# EAGLE design STBlitter_RevA (EAGLE 9.4.2)
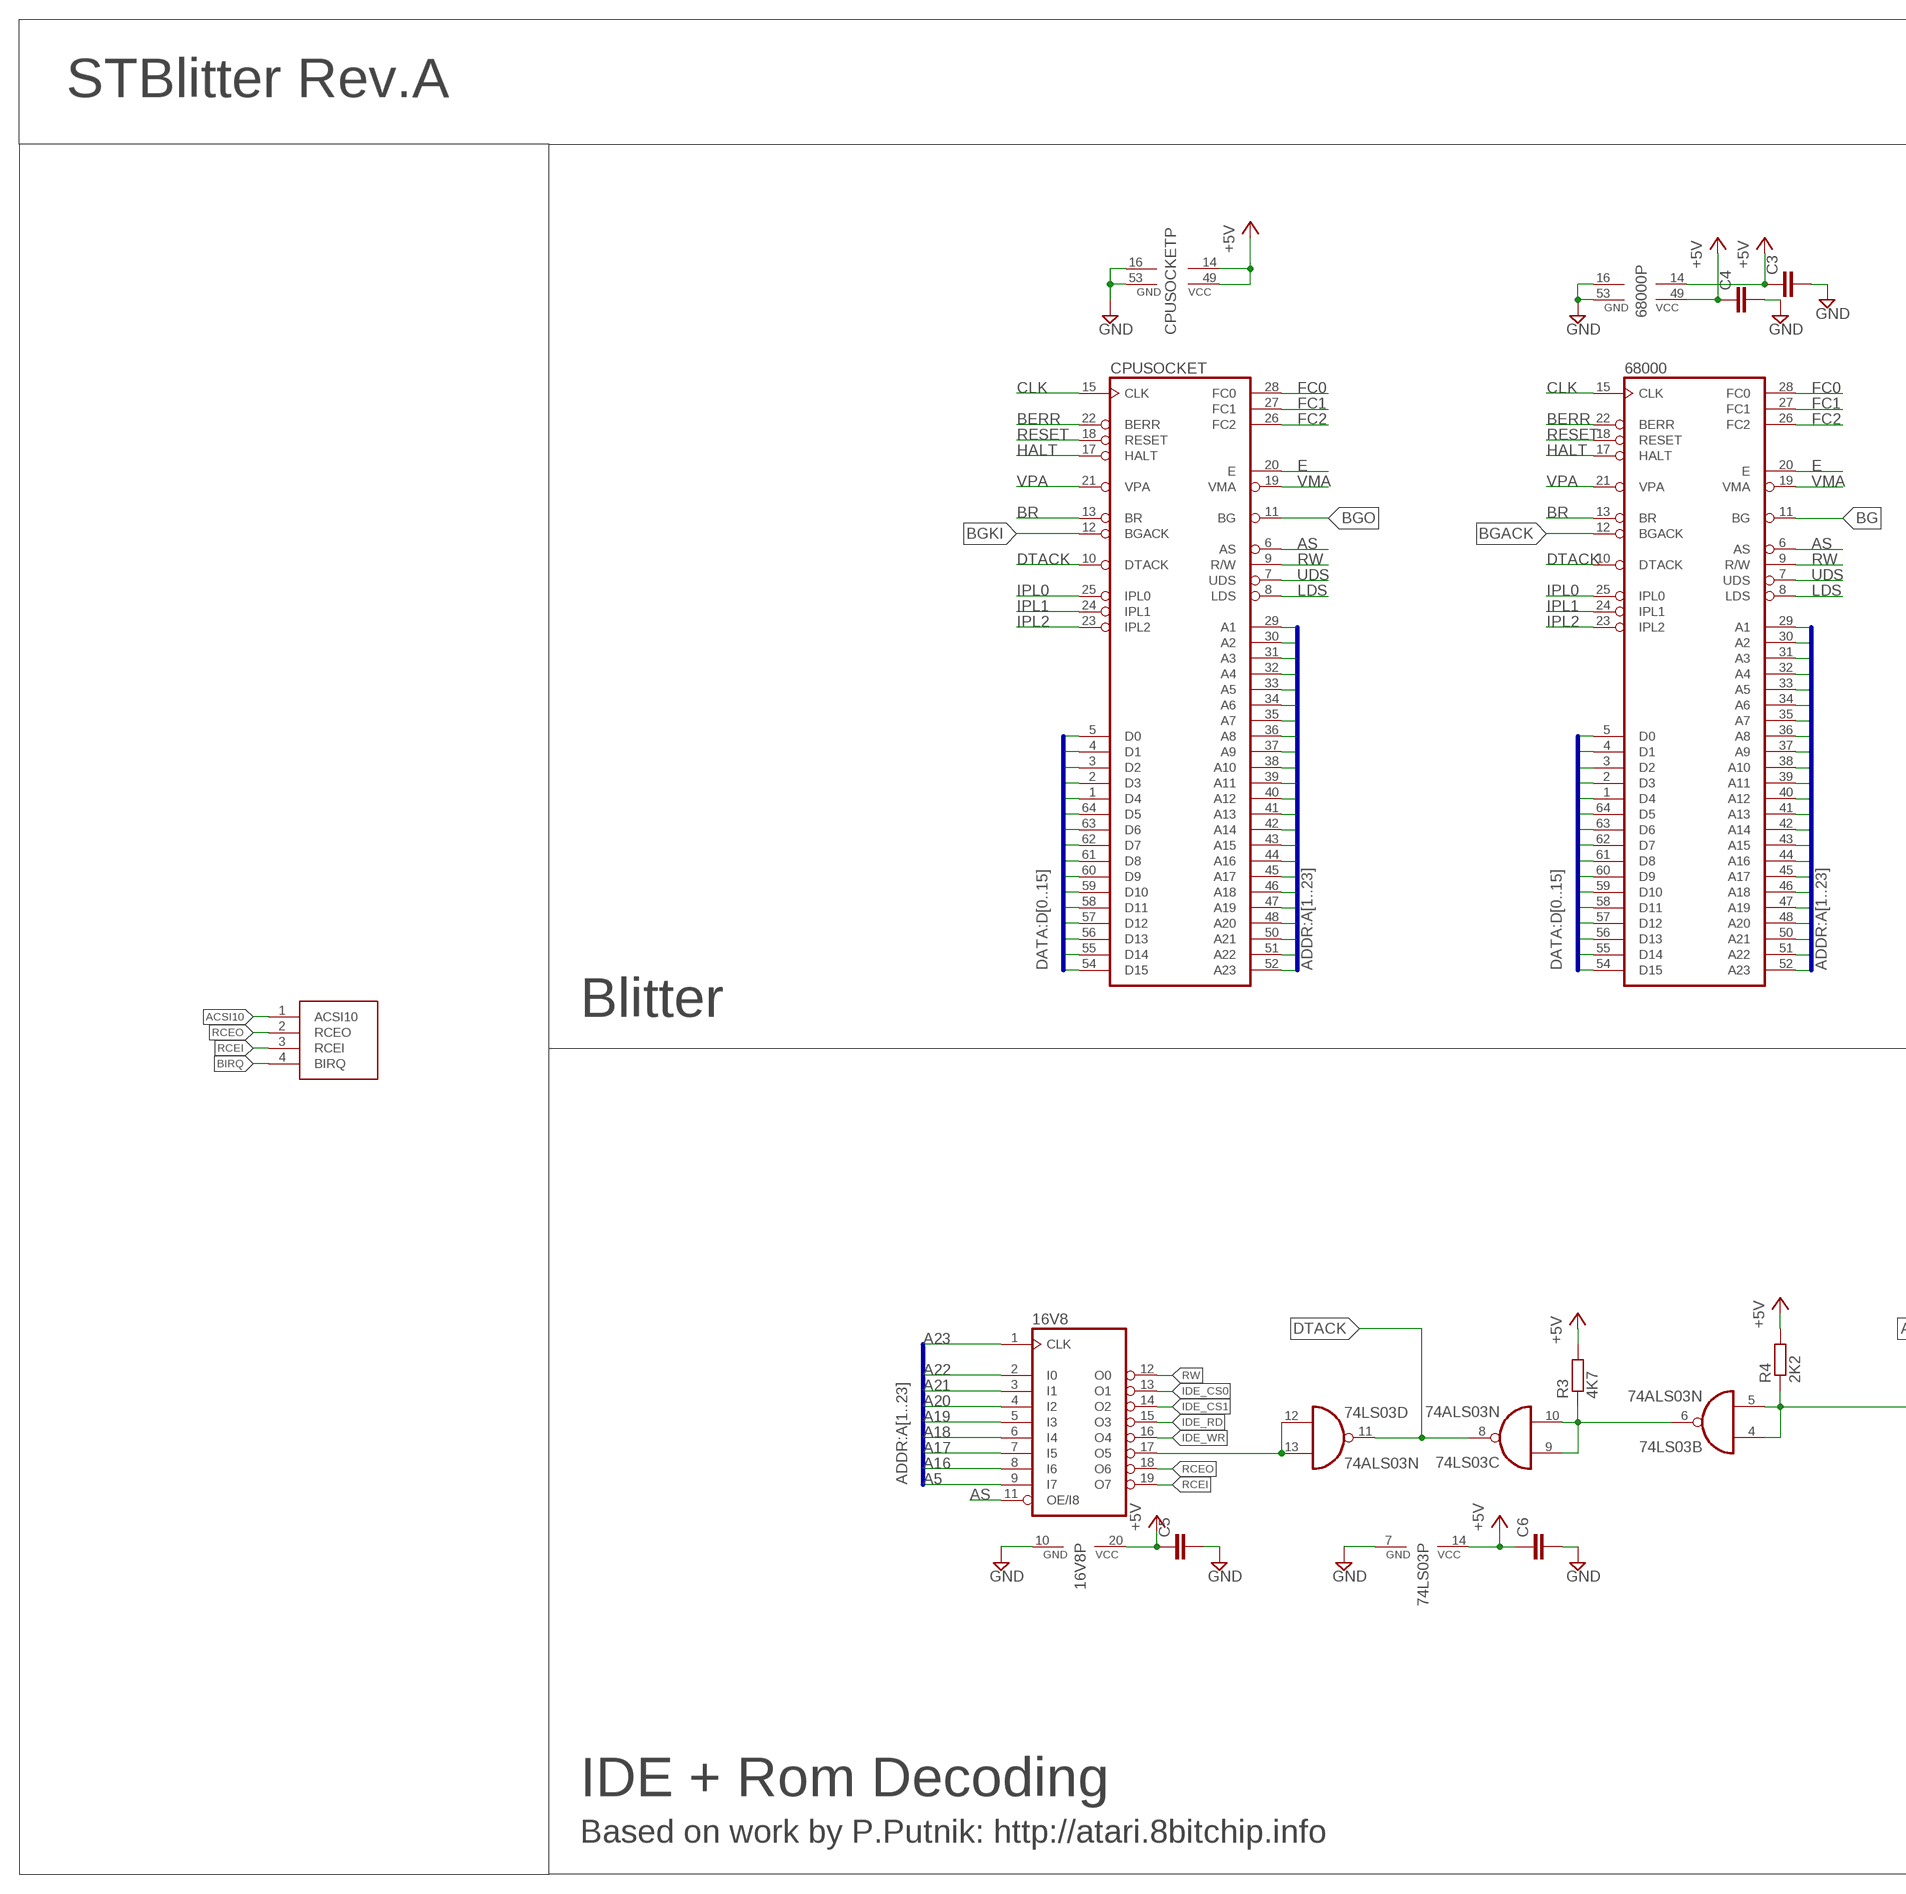
[diagram p0: schematic, sheet 1, part 1 of 2]
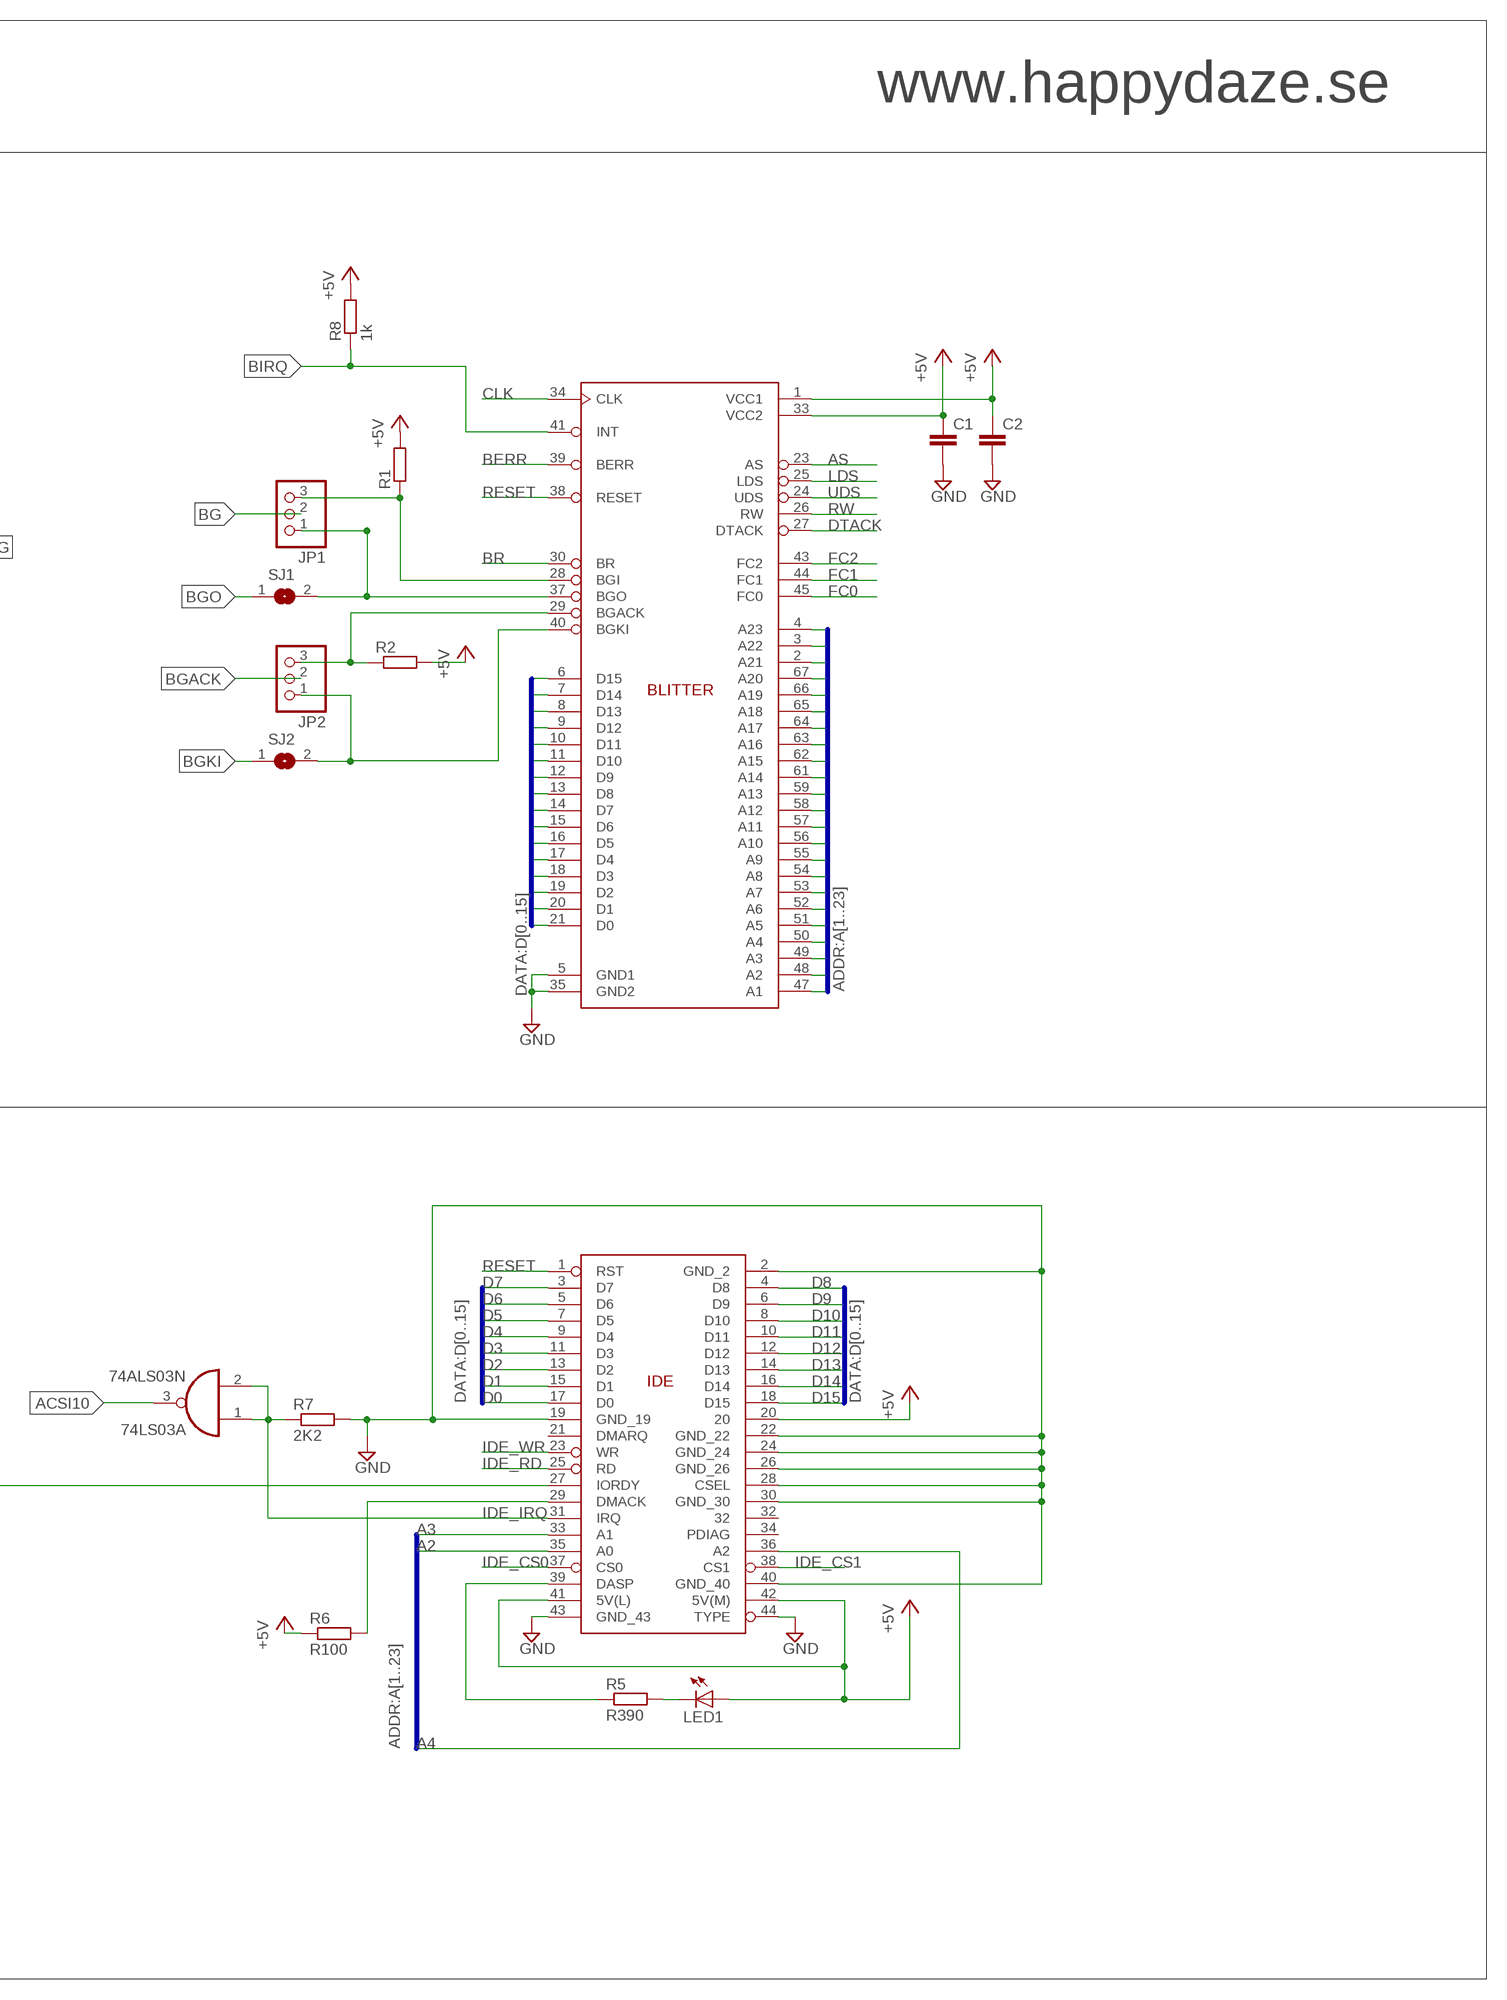
[diagram p1: schematic, sheet 1, part 2 of 2]

## Parts
16V8  16V8  [DIL20]
74LS03  74ALS03N  [DIL14]
68000  MC68000P  [DIL64]
C1  C-EU050-025X075  [C050-025X075]
C2  C-EU050-025X075  [C050-025X075]
C3  C-EU050-025X075  [C050-025X075]
C4  C-EU050-025X075  [C050-025X075]
C5  C-EU050-025X075  [C050-025X075]
C6  C-EU050-025X075  [C050-025X075]
CFCARD  IDE44_CON  [IDE44_CON]
CPUSOCKET  MC68000P  [DIL64]
JP1  PINHD-1X3  [1X03]
JP2  PINHD-1X3  [1X03]
LED1  LED3MM  [LED3MM]
R1  R-EU_0207/12  [0207/12]
R2  R-EU_0207/12  [0207/12]
R3  4K7  R-EU_0207/12  [0207/12]
R4  2K2  R-EU_0207/12  [0207/12]
R5  R390  R-EU_0207/12  [0207/12]
R6  R100  R-EU_0207/12  [0207/12]
R7  2K2  R-EU_0207/12  [0207/12]
R8  1k  R-EU_0207/12  [0207/12]
SJ1  SJ  [SJ]
SJ2  SJ  [SJ]
U$1  STBLITTER  [S68]
U$2  XCON  [XCON]

## Nets
+5V [PWR]: 16V8.20(VCC) 74LS03.14(P:VCC) 68000.14(VCC) 68000.49(VCC) C1.1 C2.1 C3.1 C4.1 C5.1 C6.1 CFCARD.20 CFCARD.41(5V(L)) CFCARD.42(5V(M)) CPUSOCKET.14(VCC) CPUSOCKET.49(VCC) LED1.A R1.2 R2.2 R3.2 R4.2 R6.1 R8.2 U$1.1(VCC1) U$1.33(VCC2)
_BGACK: JP2.3 R2.1 U$1.29(BGACK)
_BGKI: JP2.1 SJ2.2 U$1.40(BGKI)
_BGO: JP1.1 SJ1.2 U$1.37(BGO)
A1: 68000.29(A1) CPUSOCKET.29(A1) U$1.47(A1)
A2: 68000.30(A2) CFCARD.35(A0) CPUSOCKET.30(A2) U$1.48(A2)
A3: 68000.31(A3) CFCARD.33(A1) CPUSOCKET.31(A3) U$1.49(A3)
A4: 68000.32(A4) CFCARD.36(A2) CPUSOCKET.32(A4) U$1.50(A4)
A5: 16V8.9(I7) 68000.33(A5) CPUSOCKET.33(A5) U$1.51(A5)
A6: 68000.34(A6) CPUSOCKET.34(A6) U$1.52(A6)
A7: 68000.35(A7) CPUSOCKET.35(A7) U$1.53(A7)
A8: 68000.36(A8) CPUSOCKET.36(A8) U$1.54(A8)
A9: 68000.37(A9) CPUSOCKET.37(A9) U$1.55(A9)
A10: 68000.38(A10) CPUSOCKET.38(A10) U$1.56(A10)
A11: 68000.39(A11) CPUSOCKET.39(A11) U$1.57(A11)
A12: 68000.40(A12) CPUSOCKET.40(A12) U$1.58(A12)
A13: 68000.41(A13) CPUSOCKET.41(A13) U$1.59(A13)
A14: 68000.42(A14) CPUSOCKET.42(A14) U$1.61(A14)
A15: 68000.43(A15) CPUSOCKET.43(A15) U$1.62(A15)
A16: 16V8.8(I6) 68000.44(A16) CPUSOCKET.44(A16) U$1.63(A16)
A17: 16V8.7(I5) 68000.45(A17) CPUSOCKET.45(A17) U$1.64(A17)
A18: 16V8.6(I4) 68000.46(A18) CPUSOCKET.46(A18) U$1.65(A18)
A19: 16V8.5(I3) 68000.47(A19) CPUSOCKET.47(A19) U$1.66(A19)
A20: 16V8.4(I2) 68000.48(A20) CPUSOCKET.48(A20) U$1.67(A20)
A21: 16V8.3(I1) 68000.50(A21) CPUSOCKET.50(A21) U$1.2(A21)
A22: 16V8.2(I0) 68000.51(A22) CPUSOCKET.51(A22) U$1.3(A22)
A23: 16V8.1(CLK) 68000.52(A23) CPUSOCKET.52(A23) U$1.4(A23)
ACSI10: 74LS03.3(A:O) U$2.1(ACSI10)
AS: 16V8.11(OE/I8) 68000.6(AS) CPUSOCKET.6(AS) U$1.23(AS)
BERR: 68000.22(BERR) CPUSOCKET.22(BERR) U$1.39(BERR)
BG: 68000.11(BG) JP1.2
BGACK: 68000.12(BGACK) JP2.2
BGKI: CPUSOCKET.12(BGACK) SJ2.1
BGO: CPUSOCKET.11(BG) SJ1.1
BIRQ: R8.1 U$1.41(INT) U$2.4(BIRQ)
BLTBGI: JP1.3 R1.1 U$1.28(BGI)
BR: 68000.13(BR) CPUSOCKET.13(BR) U$1.30(BR)
CLK: 68000.15(CLK) CPUSOCKET.15(CLK) U$1.34(CLK)
D0: 68000.5(D0) CFCARD.17(D0) CPUSOCKET.5(D0) U$1.21(D0)
D1: 68000.4(D1) CFCARD.15(D1) CPUSOCKET.4(D1) U$1.20(D1)
D2: 68000.3(D2) CFCARD.13(D2) CPUSOCKET.3(D2) U$1.19(D2)
D3: 68000.2(D3) CFCARD.11(D3) CPUSOCKET.2(D3) U$1.18(D3)
D4: 68000.1(D4) CFCARD.9(D4) CPUSOCKET.1(D4) U$1.17(D4)
D5: 68000.64(D5) CFCARD.7(D5) CPUSOCKET.64(D5) U$1.16(D5)
D6: 68000.63(D6) CFCARD.5(D6) CPUSOCKET.63(D6) U$1.15(D6)
D7: 68000.62(D7) CFCARD.3(D7) CPUSOCKET.62(D7) U$1.14(D7)
D8: 68000.61(D8) CFCARD.4(D8) CPUSOCKET.61(D8) U$1.13(D8)
D9: 68000.60(D9) CFCARD.6(D9) CPUSOCKET.60(D9) U$1.12(D9)
D10: 68000.59(D10) CFCARD.8(D10) CPUSOCKET.59(D10) U$1.11(D10)
D11: 68000.58(D11) CFCARD.10(D11) CPUSOCKET.58(D11) U$1.10(D11)
D12: 68000.57(D12) CFCARD.12(D12) CPUSOCKET.57(D12) U$1.9(D12)
D13: 68000.56(D13) CFCARD.14(D13) CPUSOCKET.56(D13) U$1.8(D13)
D14: 68000.55(D14) CFCARD.16(D14) CPUSOCKET.55(D14) U$1.7(D14)
D15: 68000.54(D15) CFCARD.18(D15) CPUSOCKET.54(D15) U$1.6(D15)
DTACK: 74LS03.8(C:O) 74LS03.11(D:O) 68000.10(DTACK) CPUSOCKET.10(DTACK) U$1.27(DTACK)
E: 68000.20(E) CPUSOCKET.20(E)
FC0: 68000.28(FC0) CPUSOCKET.28(FC0) U$1.45(FC0)
FC1: 68000.27(FC1) CPUSOCKET.27(FC1) U$1.44(FC1)
FC2: 68000.26(FC2) CPUSOCKET.26(FC2) U$1.43(FC2)
GND [GND]: 16V8.10(GND) 74LS03.7(P:GND) 68000.16(GND) 68000.53(GND) C1.2 C2.2 C3.2 C4.2 C5.2 C6.2 CFCARD.2(GND_2) CFCARD.19(GND_19) CFCARD.22(GND_22) CFCARD.24(GND_24) CFCARD.26(GND_26) CFCARD.28(CSEL) CFCARD.30(GND_30) CFCARD.40(GND_40) CFCARD.43(GND_43) CFCARD.44(TYPE) CPUSOCKET.16(GND) CPUSOCKET.53(GND) R7.2 U$1.5(GND1) U$1.35(GND2)
HALT: 68000.17(HALT) CPUSOCKET.17(HALT)
IDE_CS0: 16V8.13(O1) CFCARD.37(CS0)
IDE_CS1: 16V8.14(O2) CFCARD.38(CS1)
IDE_IRQ: 74LS03.1(A:I0) 74LS03.2(A:I1) CFCARD.31(IRQ) R7.1
IDE_RD: 16V8.15(O3) CFCARD.25(RD)
IDE_WR: 16V8.16(O4) CFCARD.23(WR)
IPL0: 68000.25(IPL0) CPUSOCKET.25(IPL0)
IPL1: 68000.24(IPL1) CPUSOCKET.24(IPL1)
IPL2: 68000.23(IPL2) CPUSOCKET.23(IPL2)
LDS: 68000.8(LDS) CPUSOCKET.8(LDS) U$1.25(LDS)
N$2: 16V8.17(O5) 74LS03.12(D:I0) 74LS03.13(D:I1)
N$3: 74LS03.6(B:O) 74LS03.9(C:I0) 74LS03.10(C:I1) R3.1
N$4: 74LS03.4(B:I0) 74LS03.5(B:I1) CFCARD.27(IORDY) R4.1
N$7: CFCARD.29(DMACK) R6.2
N$13: CFCARD.39(DASP) R5.1
N$14: LED1.K(C) R5.2
RCEI: 16V8.19(O7) U$2.3(RCEI)
RCEO: 16V8.18(O6) U$2.2(RCEO)
RESET: 68000.18(RESET) CFCARD.1(RST) CPUSOCKET.18(RESET) U$1.38(RESET)
RW: 16V8.12(O0) 68000.9(R/W) CPUSOCKET.9(R/W) U$1.26(RW)
UDS: 68000.7(UDS) CPUSOCKET.7(UDS) U$1.24(UDS)
VMA: 68000.19(VMA) CPUSOCKET.19(VMA)
VPA: 68000.21(VPA) CPUSOCKET.21(VPA)
Unconnected: CFCARD.21(DMARQ) CFCARD.32 CFCARD.34(PDIAG)

## Buses
DATA:D[0..15]
ADDR:A[1..23]

## Notes on the sheet
- STBlitter Rev.A | www.happydaze.se
- Blitter
- IDE + Rom Decoding
- Based on work by P.Putnik: http://atari.8bitchip.info

## Library data of the parts
16V8 = pal:16V8: PAL; MPN: GAL16V8D-7LPN; OC_FARNELL: 9699740; OC_NEWARK: 97K0449
74LS03 = 74xx-eu:74*03: Quad 2-input NAND gate, open collector output
68000 CPUSOCKET = micro-mc68000:MC68000P: 68xxx PROCESSOR; OC_FARNELL: unknown; OC_NEWARK: unknown
C1-C6 = rcl:C-EU: CAPACITOR, European symbol; SPICEPREFIX: C
CFCARD = AtariST:IDE44_CON
JP1 JP2 = pinhead:PINHD-1X3: PIN HEADER
LED1 = led:LED: LED OSRAM: - CHIPLED LG R971, LG N971, LY N971, LG Q971, LY Q971, LO R971, LY R971 LH N974, LH R974 LS Q976, LO Q976, LY Q976 LO Q996 - Hyper CHIPLED LW Q18S LB Q993, LB Q99A, LB R99A - SideLED LS A670, LO A670, LY A670, LG A670, LP A670 LB A673, LV A673, LT A673, LW A673 LH A674 LY A675 LS A676, LA A676, LO A676, LY A676, LW A676 LS A679, LY A679, LG A679 - Hyper Micro SIDELED® LS Y876, LA Y876, LO Y876, LY Y876 LT Y87S - SmartLED LW L88C, LW L88S LB L89C, LB L89S, LG L890 LS L89K, LO L89K, LY L89K LS L896, LA L896, LO L896, LY L896 - TOPLED LS T670, LO T670, LY T670, LG T670, LP T670 LSG T670, LSP T670, LSY T670, LOP T670, LYG T670 LG T671, LOG T671, LSG T671 LB T673, LV T673, LT T673, LW T673 LH T674 LS T676, LA T676, LO T676, LY T676, LB T676, LH T676, LSB T676, LW T676 LB T67C, LV T67C, LT T67C, LS T67K, LO T67K, LY T67K, LW E67C LS E67B, LA E67B, LO E67B, LY E67B, LB E67C, LV E67C, LT E67C LW T67C LS T679, LY T679, LG T679 LS T770, LO T770, LY T770, LG T770, LP T770 LB T773, LV T773, LT T773, LW T773 LH T774 LS E675, LA E675, LY E675, LS T675 LS T776, LA T776, LO T776, LY T776, LB T776 LHGB T686 LT T68C, LB T68C - Hyper Mini TOPLED® LB M676 - Mini TOPLED Santana® LG M470 LS M47K, LO M47K, LY M47K Source: http://www.osram.convergy.de LUXEON: - LUMILED® LXK2-PW12-R00, LXK2-PW12-S00, LXK2-PW14-U00, LXK2-PW14-V00 LXK2-PM12-R00, LXK2-PM12-S00, LXK2-PM14-U00 LXK2-PE12-Q00, LXK2-PE12-R00, LXK2-PE12-S00, LXK2-PE14-T00, LXK2-PE14-U00 LXK2-PB12-K00, LXK2-PB12-L00, LXK2-PB12-M00, LXK2-PB14-N00, LXK2-PB14-P00, LXK2-PB14-Q00 LXK2-PR12-L00, LXK2-PR12-M00, LXK2-PR14-Q00, LXK2-PR14-R00 LXK2-PD12-Q00, LXK2-PD12-R00, LXK2-PD12-S00 LXK2-PH12-R00, LXK2-PH12-S00 LXK2-PL12-P00, LXK2-PL12-Q00, LXK2-PL12-R00 Source: www.luxeon.com KINGBRIGHT: KA-3528ASYC Source: www.kingbright.com
R1-R8 = resistor:R-EU_: RESISTOR, European symbol
SJ1 SJ2 = jumper:SJ: SMD solder JUMPER
U$1 = AtariST:STBLITTER
U$2 = AtariST:XCON

## Net classes
0 default: width 0.203 mm
1 PWR: width 0.813 mm
2 GND: width 0.813 mm

## Board
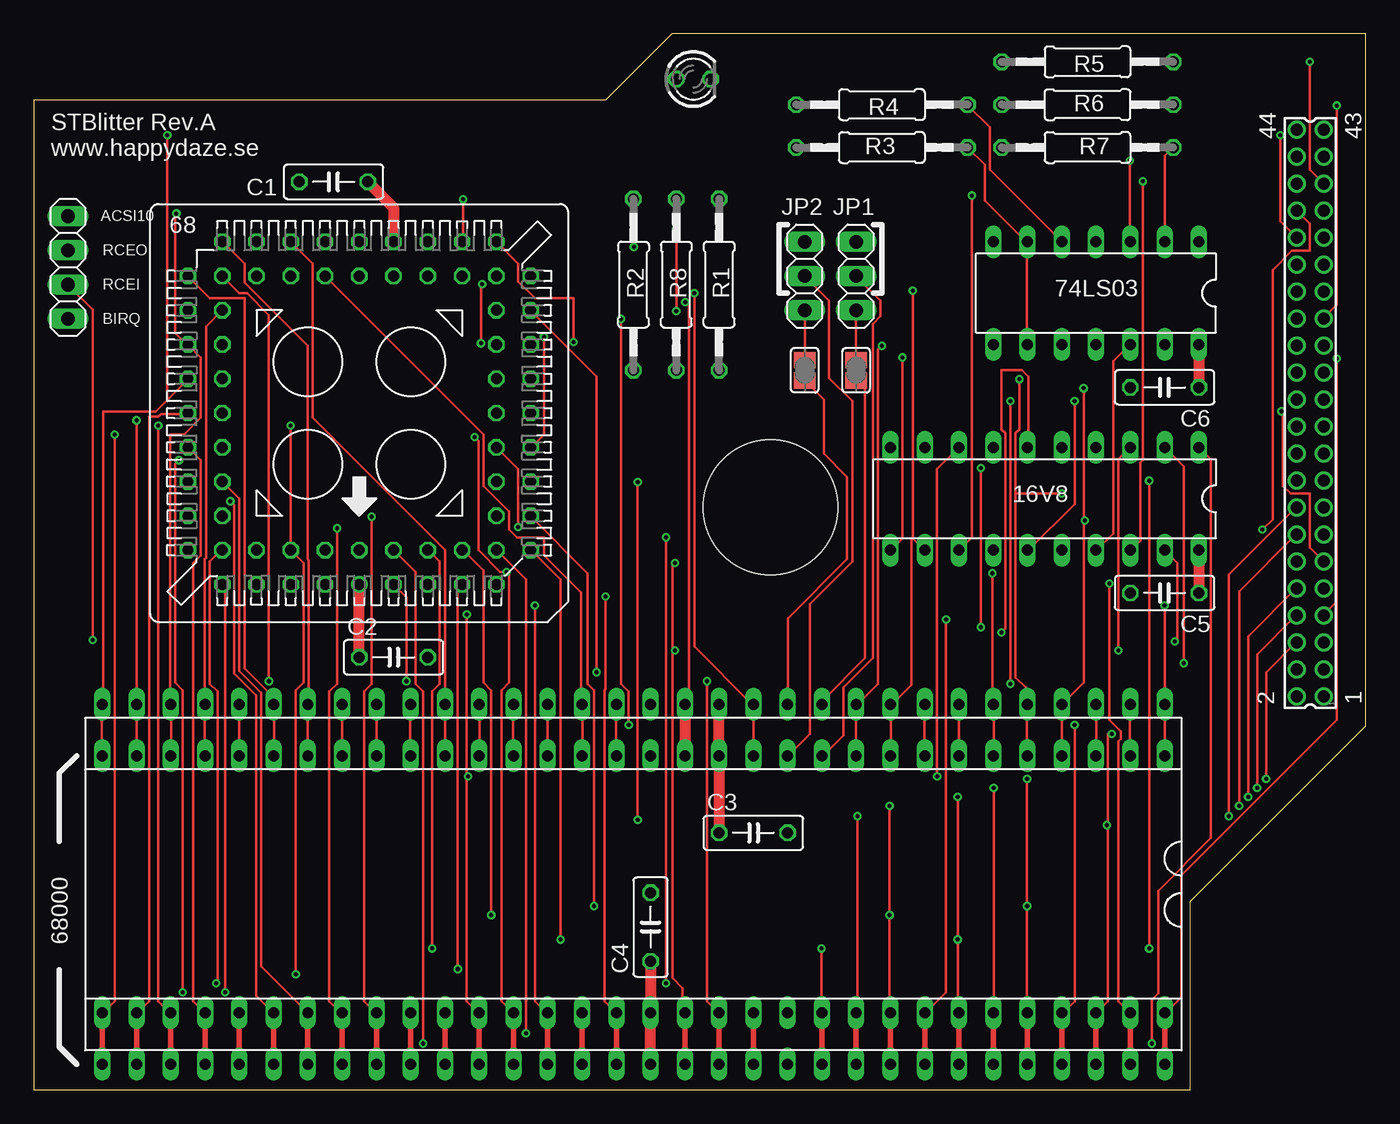
[diagram p2: board, top side]
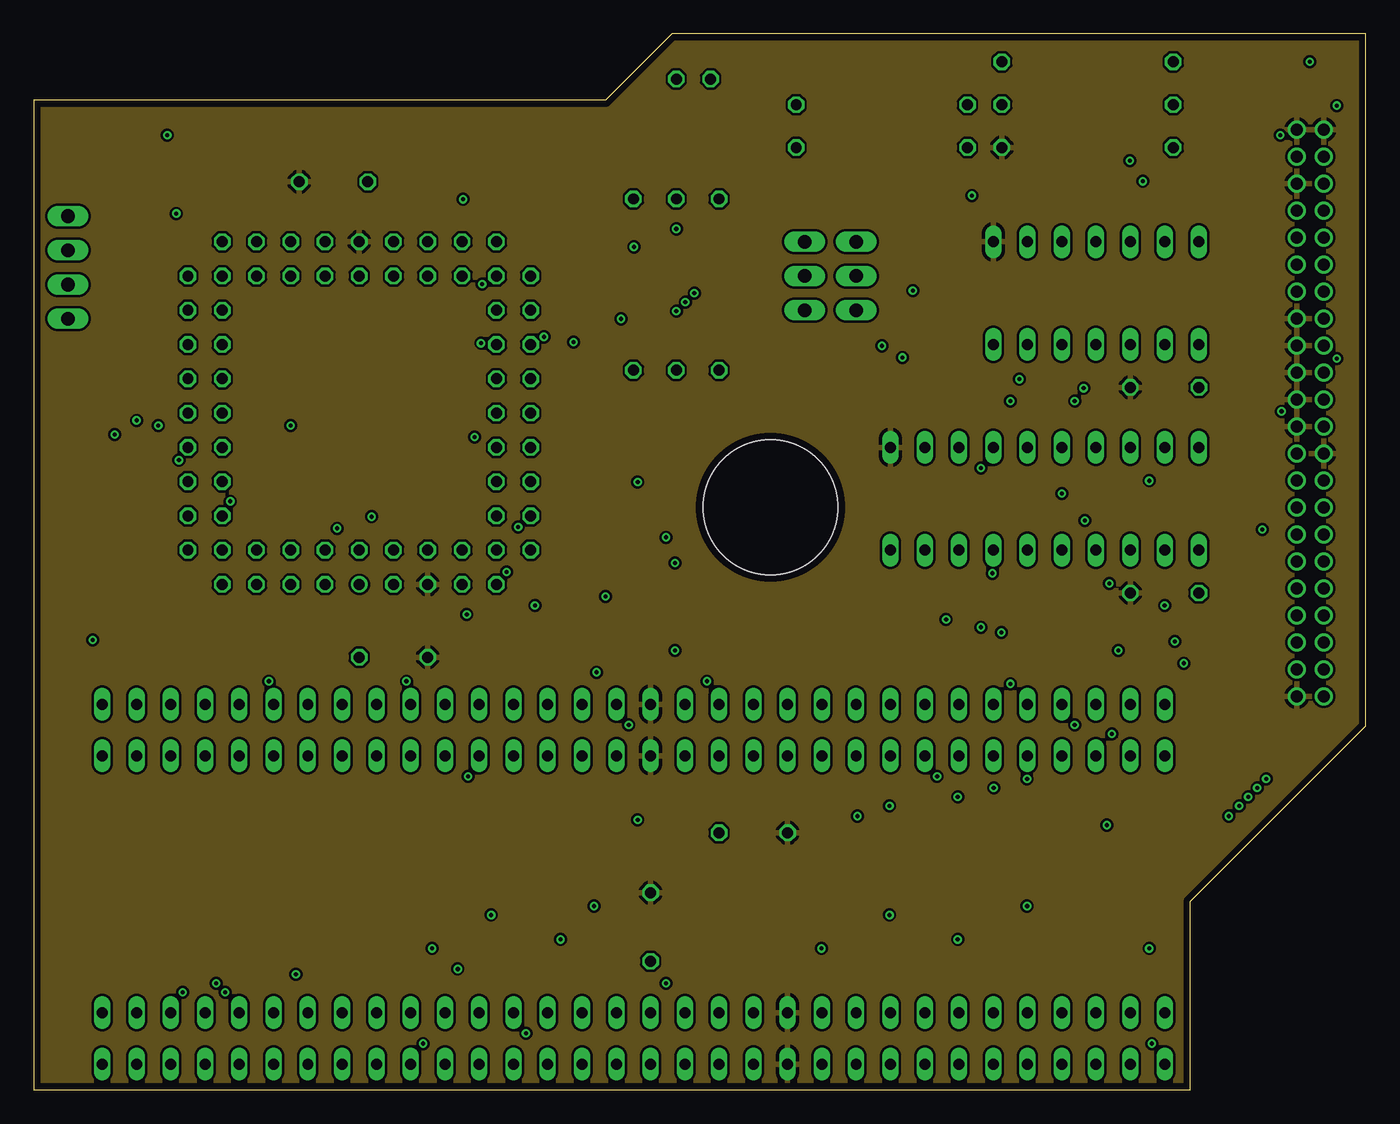
[diagram p3: board, inner layer Route2]
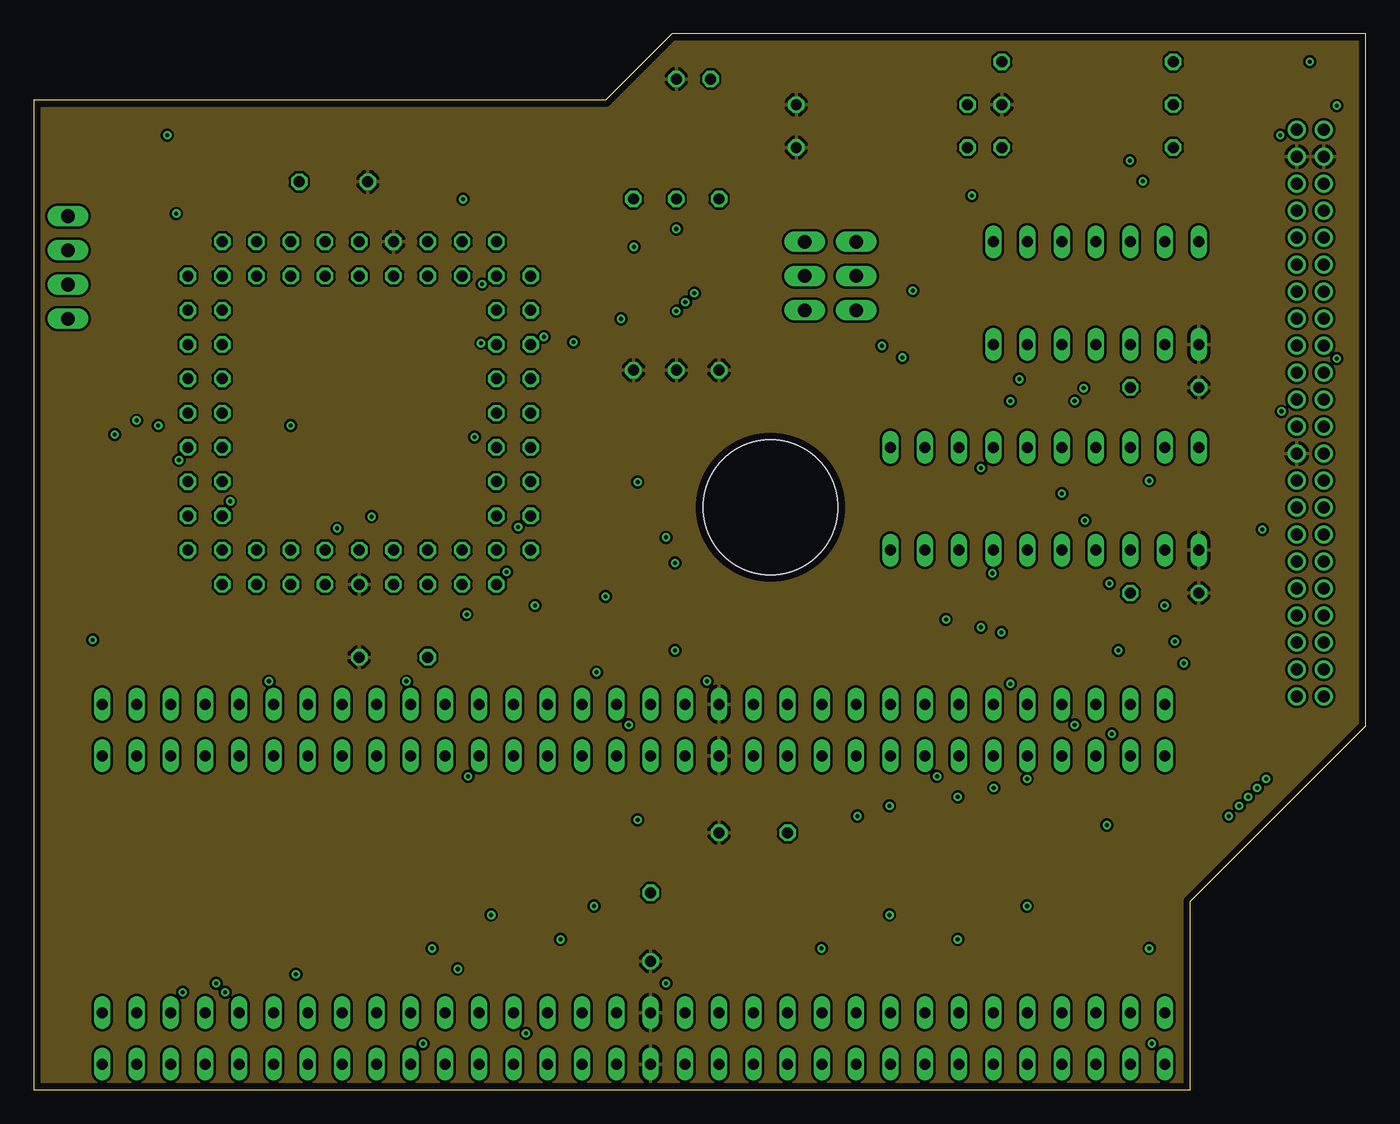
[diagram p4: board, inner layer Route15]
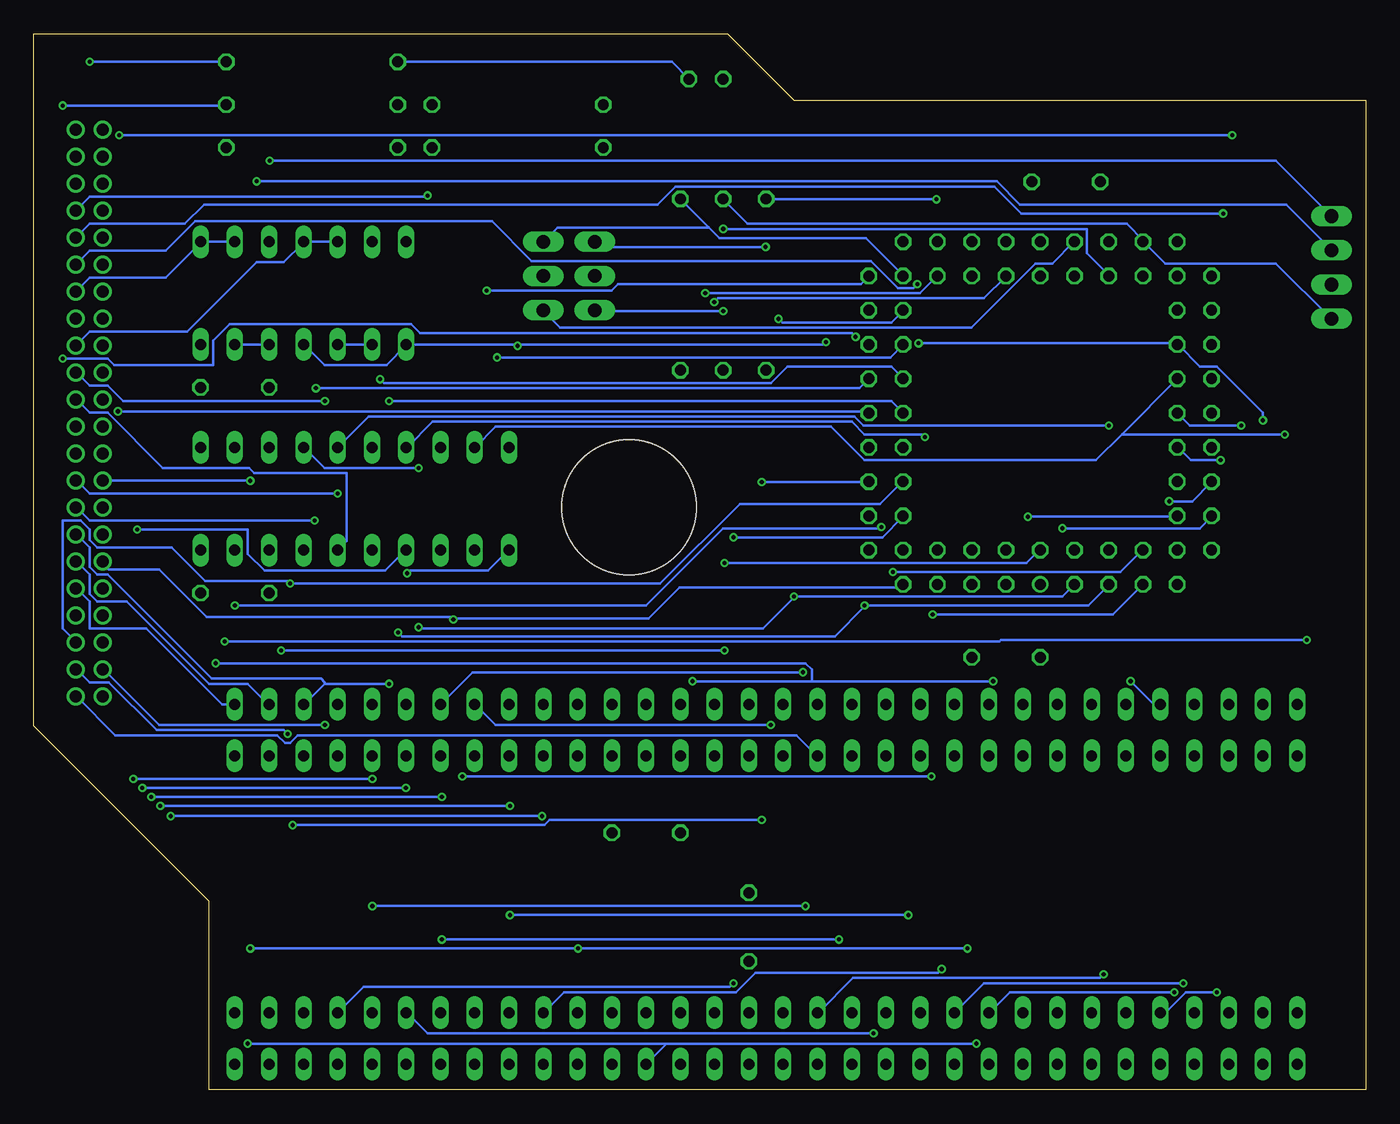
[diagram p5: board, bottom side, seen from below]

Size 98.73 x 78.28 mm. Coordinates in mm from the lower left corner, seen from the top.
Outline: 0,0 85.73,0 85.73,13.97 98.73,26.98 98.73,78.28 47.3,78.28 42.38,73.36 0,73.36 0,0
Copper layers (1*2*15*16): Top 0.035mm / dielectric 0.2mm / Route2 0.035mm / dielectric 1.2mm / Route15 0.035mm / dielectric 0.2mm / Bottom 0.035mm
Design rules "Elecrow_4-layer_PCB_eagle_rule *": minimum track width 7mil, minimum drill 12mil, track to track 7mil, track to pad 7mil, pad to pad 7mil, via to via 7mil, smd to smd 0mil, copper to edge 20mil, drill to drill 10mil, minimum pad ring 6mil, minimum via ring 6mil, stop-mask expansion 0mil, vias tented up to drill 100mil, thermal gap 10mil
Holes 10 mm at 54.61,43.18

### Footprints (pad centres in the part's own frame; a part is rotated, then mirrored left to right if it is on the bottom)
DIL20 = drill 0.813 long: 1 -11.43,-3.81; 2 -8.89,-3.81; 3 -6.35,-3.81; 4 -3.81,-3.81; 5 -1.27,-3.81; 6 1.27,-3.81; 7 3.81,-3.81; 8 6.35,-3.81; 9 8.89,-3.81; 10 11.43,-3.81; 11 11.43,3.81; 12 8.89,3.81; 13 6.35,3.81; 14 3.81,3.81; 15 1.27,3.81; 16 -1.27,3.81; 17 -3.81,3.81; 18 -6.35,3.81; 19 -8.89,3.81; 20 -11.43,3.81
DIL14 = drill 0.813 long: 1 -7.62,-3.81; 2 -5.08,-3.81; 3 -2.54,-3.81; 4 0,-3.81; 5 2.54,-3.81; 6 5.08,-3.81; 7 7.62,-3.81; 8 7.62,3.81; 9 5.08,3.81; 10 2.54,3.81; 11 0,3.81; 12 -2.54,3.81; 13 -5.08,3.81; 14 -7.62,3.81
DIL64 = drill 0.813 long: 1 -39.37,-11.43; 2 -36.83,-11.43; 3 -34.29,-11.43; 4 -31.75,-11.43; 5 -29.21,-11.43; 6 -26.67,-11.43; 7 -24.13,-11.43; 8 -21.59,-11.43; 9 -19.05,-11.43; 10 -16.51,-11.43; 11 -13.97,-11.43; 12 -11.43,-11.43; 13 -8.89,-11.43; 14 -6.35,-11.43; 15 -3.81,-11.43; 16 -1.27,-11.43; 17 1.27,-11.43; 18 3.81,-11.43; 19 6.35,-11.43; 20 8.89,-11.43; 21 11.43,-11.43; 22 13.97,-11.43; 23 16.51,-11.43; 24 19.05,-11.43; 25 21.59,-11.43; 26 24.13,-11.43; 27 26.67,-11.43; 28 29.21,-11.43; 29 31.75,-11.43; 30 34.29,-11.43; 31 36.83,-11.43; 32 39.37,-11.43; 33 39.37,11.43; 34 36.83,11.43; 35 34.29,11.43; 36 31.75,11.43; 37 29.21,11.43; 38 26.67,11.43; 39 24.13,11.43; 40 21.59,11.43; 41 19.05,11.43; 42 16.51,11.43; 43 13.97,11.43; 44 11.43,11.43; 45 8.89,11.43; 46 6.35,11.43; 47 3.81,11.43; 48 1.27,11.43; 49 -1.27,11.43; 50 -3.81,11.43; 51 -6.35,11.43; 52 -8.89,11.43; 53 -11.43,11.43; 54 -13.97,11.43; 55 -16.51,11.43; 56 -19.05,11.43; 57 -21.59,11.43; 58 -24.13,11.43; 59 -26.67,11.43; 60 -29.21,11.43; 61 -31.75,11.43; 62 -34.29,11.43; 63 -36.83,11.43; 64 -39.37,11.43
C050-025X075 = drill 0.813 octagon: 1 -2.54,0; 2 2.54,0
IDE44_CON = drill 0.9 pad 1.27: 1 -21,-1; 2 -21,1; 3 -19,-1; 4 -19,1; 5 -17,-1; 6 -17,1; 7 -15,-1; 8 -15,1; 9 -13,-1; 10 -13,1; 11 -11,-1; 12 -11,1; 13 -9,-1; 14 -9,1; 15 -7,-1; 16 -7,1; 17 -5,-1; 18 -5,1; 19 -3,-1; 20 -3,1; 21 -1,-1; 22 -1,1; 23 1,-1; 24 1,1; 25 3,-1; 26 3,1; 27 5,-1; 28 5,1; 29 7,-1; 30 7,1; 31 9,-1; 32 9,1; 33 11,-1; 34 11,1; 35 13,-1; 36 13,1; 37 15,-1; 38 15,1; 39 17,-1; 40 17,1; 41 19,-1; 42 19,1; 43 21,-1; 44 21,1
1X03 = drill 1.016 long: 1 -2.54,0; 2 0,0; 3 2.54,0
LED3MM = drill 0.813 octagon: A -1.27,0; K 1.27,0
0207/12 = drill 0.813 octagon: 1 -6.35,0; 2 6.35,0
SJ = smd 1.168 x 1.6: 1 -0.762,0; 2 0.762,0
S68 = drill 0.813: 1 0,12.7 | drill 0.813 octagon: 2 0,10.16; 3 -2.54,12.7; 4 -2.54,10.16; 5 -5.08,12.7; 6 -5.08,10.16; 7 -7.62,12.7; 8 -7.62,10.16; 9 -10.16,12.7; 10 -12.7,10.16; 11 -10.16,10.16; 12 -12.7,7.62; 13 -10.16,7.62; 14 -12.7,5.08; 15 -10.16,5.08; 16 -12.7,2.54; 17 -10.16,2.54; 18 -12.7,0; 19 -10.16,0; 20 -12.7,-2.54; 21 -10.16,-2.54; 22 -12.7,-5.08; 23 -10.16,-5.08; 24 -12.7,-7.62; 25 -10.16,-7.62; 26 -12.7,-10.16; 27 -10.16,-12.7; 28 -10.16,-10.16; 29 -7.62,-12.7; 30 -7.62,-10.16; 31 -5.08,-12.7; 32 -5.08,-10.16; 33 -2.54,-12.7; 34 -2.54,-10.16; 35 0,-12.7; 36 0,-10.16; 37 2.54,-12.7; 38 2.54,-10.16; 39 5.08,-12.7; 40 5.08,-10.16; 41 7.62,-12.7; 42 7.62,-10.16; 43 10.16,-12.7; 44 12.7,-10.16; 45 10.16,-10.16; 46 12.7,-7.62; 47 10.16,-7.62; 48 12.7,-5.08; 49 10.16,-5.08; 50 12.7,-2.54; 51 10.16,-2.54; 52 12.7,0; 53 10.16,0; 54 12.7,2.54; 55 10.16,2.54; 56 12.7,5.08; 57 10.16,5.08; 58 12.7,7.62; 59 10.16,7.62; 60 12.7,10.16; 61 10.16,12.7; 62 10.16,10.16; 63 7.62,12.7; 64 7.62,10.16; 65 5.08,12.7; 66 5.08,10.16; 67 2.54,12.7; 68 2.54,10.16
XCON = drill 1.016 long: 1 0,3.81; 2 0,1.27; 3 0,-1.27; 4 0,-3.81

### Placement (x,y rotation side)
16V8  74.93,43.81 180 top
74LS03  78.74,59.05 180 top
68000  44.45,13.34 180 top
C1  22.23,67.31 180 top
C2  26.67,32.07 0 top
C3  53.34,19.05 0 top
C4  45.72,12.06 90 top
C5  83.82,36.83 180 top
C6  83.82,52.07 180 top
CFCARD  94.61,50.16 90 top
CPUSOCKET  44.45,17.14 180 top
JP1  60.96,60.33 90 top
JP2  57.15,60.33 90 top
LED1  48.9,74.93 0 top
R1  50.8,59.69 270 top
R2  44.45,59.69 270 top
R3  62.87,69.85 180 top
R4  62.87,73.03 180 top
R5  78.11,76.2 180 top
R6  78.11,73.03 0 top
R7  78.11,69.85 180 top
R8  47.62,59.69 270 top
SJ1  60.96,53.34 90 top
SJ2  57.15,53.34 90 top
U$1  24.13,50.16 180 top
U$2  2.54,60.96 0 top

### Tracks (layer width: path | path; a pad name or v marks a point on that pad's centre or on a via)
+5V
  Top 0.813: 68000.49 CPUSOCKET.49 C4.1 | CPUSOCKET.14 68000.14 C3.1 | C2.1 U$1.1 | C1.1 26.67,65.41 U$1.33 | 74LS03.14 C6.1 | 16V8.20 C5.1
  pour Route15: -1.27,-1.27 -1.27,82.55 101.6,82.55 101.6,-1.27
_BGACK  (via drill 0.3)
  Top 0.203: v31.81,66.01 31.81,62.87 U$1.29 | v44.48,62.48 44.48,66.01 R2.1
  Bottom 0.203: v31.81,66.01 44.39,66.01 R2.1 | JP2.3 56.77,62.48 v44.48,62.48
_BGKI  (via drill 0.3)
  Top 0.203: JP2.1 SJ2.2 | v47.62,57.72 v47.62,63.82
  Bottom 0.203: v47.62,63.82 20.67,63.82 20.67,62.01 19.05,60.39 U$1.40 | v47.62,57.72 57.15,57.72 JP2.1
_BGO
  Top 0.203: JP1.1 SJ1.2
  Bottom 0.203: U$1.37 21.62,62.87 23.24,61.25 24.48,61.25 29.24,56.48 59.72,56.48 60.96,57.72 JP1.1
A1
  Top 0.203: 68000.29 12.67,24.77 12.67,28.57 CPUSOCKET.29 12.67,28.67 12.67,39.34 12.76,39.43 12.76,56.58 U$1.47
A2  (via drill 0.3)
  Top 0.203: 68000.30 10.19,24.77 10.19,28.57 CPUSOCKET.30 10.1,28.57 10.1,48.58 11.14,48.58 12.38,49.82 12.38,54.29 U$1.48 11.34,55.24 10.48,56.1 10.48,64.86 v10.57,64.96
  Bottom 0.203: v10.57,64.96 25.53,64.96 27.53,66.96 51.15,66.96 52.48,65.63 86.11,65.63 87.53,64.2 94.58,64.2 95.54,63.25 CFCARD.35
A3  (via drill 0.3)
  Top 0.203: 68000.31 CPUSOCKET.31 v7.62,49.62 | v33.24,59.72 33.15,59.63 v33.15,55.34
  Bottom 0.203: v7.62,49.62 7.62,50.2 11.05,53.63 12.29,53.63 13.91,55.24 U$1.49 14,55.34 v33.15,55.34 | v33.24,59.72 33.53,59.44 34.67,59.44 36.67,61.44 61.82,61.44 64.77,64.39 86.77,64.39 88.96,62.2 94.58,62.2 95.54,61.25 CFCARD.33
A4  (via drill 0.3)
  Top 0.203: 68000.32 5.05,24.77 5.05,28.57 CPUSOCKET.32 5.14,28.57 5.14,50.29 9.05,50.29 9.95,51.2 | 9.95,51.2 11.43,52.67 U$1.50 | v92.39,70.77 92.39,64.39 93.53,63.25 CFCARD.36 | v9.91,70.77 9.91,51.24 9.95,51.2
  Bottom 0.203: v9.91,70.77 v92.39,70.77
A5  (via drill 0.3)
  Top 0.203: v6,48.58 6,6.57 5.24,5.81 CPUSOCKET.33
  Top 0.406: 68000.33 CPUSOCKET.33
  Bottom 0.203: U$1.51 18.05,48.62 | 18.05,48.62 20,46.67 37.15,46.67 39.62,49.15 64.48,49.15 66.01,47.62 16V8.9 | v6,48.58 18,48.58 18.05,48.62
A6
  Top 0.203: U$1.52 11.43,50.1 9.43,50.1 9.24,49.91 8.57,49.91 8.57,6.57 7.81,5.81 CPUSOCKET.34
  Top 0.406: 68000.34 CPUSOCKET.34
A7  (via drill 0.3)
  Top 0.203: v9.24,49.24 9.24,6.57 10,5.81 CPUSOCKET.35
  Top 0.406: CPUSOCKET.35 68000.35
  Bottom 0.203: U$1.53 13.05,49.24 v9.24,49.24
A8
  Top 0.203: U$1.54 12.38,46.67 12.38,39.62 11.81,39.05 11.81,6.57 12.57,5.81 CPUSOCKET.36
  Top 0.406: 68000.36 CPUSOCKET.36
A9  (via drill 0.3)
  Top 0.203: v10.76,46.67 10.48,46.39 10.48,30.19 11.05,29.62 v11.05,7.24
  Top 0.406: CPUSOCKET.37 68000.37
  Bottom 0.203: v10.76,46.67 12.95,46.67 13.91,47.62 U$1.55 | v11.05,7.24 13.34,7.24 14.86,5.71 CPUSOCKET.37
A10  (via drill 0.3)
  Top 0.203: v14.57,43.62 14.86,43.34 14.86,30.86 16.48,29.24 16.48,6.95 17.62,5.81 CPUSOCKET.38
  Top 0.406: CPUSOCKET.38 68000.38
  Bottom 0.203: v14.57,43.62 12.86,43.62 11.43,45.05 U$1.56
A11
  Top 0.203: U$1.57 15.24,43.81 15.24,31.05 16.86,29.43 16.86,9.14 20.19,5.81 CPUSOCKET.39
  Top 0.406: 68000.39 CPUSOCKET.39
A12  (via drill 0.3)
  Top 0.203: v22.48,41.62 22.48,30.1 21.91,29.53 21.91,6.57 22.67,5.81 CPUSOCKET.40
  Top 0.406: CPUSOCKET.40 68000.40
  Bottom 0.203: v22.48,41.62 12.29,41.62 11.43,42.48 U$1.58
A13  (via drill 0.3)
  Top 0.203: v25.05,42.48 25.05,30.1 24.48,29.53 24.48,6.57 25.24,5.81 CPUSOCKET.41
  Top 0.406: 68000.41 CPUSOCKET.41
  Bottom 0.203: v25.05,42.48 14,42.48 U$1.59
A14  (via drill 0.3)
  Top 0.203: U$1.61 14.19,37.24 v14.19,7.24
  Top 0.406: CPUSOCKET.42 68000.42
  Bottom 0.203: v14.19,7.24 26.38,7.24 27.91,5.71 CPUSOCKET.42
A15  (via drill 0.3)
  Top 0.203: v13.53,7.91 13.62,8 13.62,29.53 13.05,30.1 13.05,39.15 13.91,40.01 U$1.62
  Top 0.406: 68000.43 CPUSOCKET.43
  Bottom 0.203: v13.53,7.91 28.29,7.91 CPUSOCKET.43
A16  (via drill 0.3)
  Top 0.203: 32.1,23.24 32.1,6.57 32.86,5.81 CPUSOCKET.44 | 32.1,23.24 v32.1,35.24 | 16V8.8 66.96,46.01 v66.96,23.24 | v32.19,23.24 32.1,23.24
  Top 0.406: CPUSOCKET.44 68000.44
  Bottom 0.203: v32.1,35.24 18.76,35.24 16.57,37.43 U$1.63 | v32.19,23.24 v66.96,23.24
A17  (via drill 0.3)
  Top 0.203: CPUSOCKET.45 35.43,5.81 34.67,6.57 34.67,29.62 35.24,30.19 35.24,38.2 v35.05,38.39 34.58,38.39 32.96,40.01 32.96,48.1 v32.67,48.39
  Top 0.406: CPUSOCKET.45 68000.45
  Bottom 0.203: v35.05,38.39 18.19,38.39 16.57,40.01 U$1.64 | v32.67,48.39 32.86,48.58 37.15,48.58 38.1,49.53 69.15,49.53 71.06,47.62 16V8.7
A18  (via drill 0.3)
  Top 0.203: v37.15,35.91 37.15,6.57 37.91,5.81 CPUSOCKET.46 | v71.72,33.91 72.01,34.2 72.01,48.67 71.72,48.96 71.72,53.34 73.25,53.34 73.72,52.86 73.72,47.62 16V8.6
  Top 0.406: CPUSOCKET.46 68000.46
  Bottom 0.203: U$1.65 19.05,37.43 20.57,35.91 v37.15,35.91 37.15,35.81 39.34,33.62 71.44,33.62 v71.72,33.91
A19  (via drill 0.3)
  Top 0.203: v19.43,8.57 19.43,29.62 20,30.19 20,39.05 U$1.66 v19.05,49.24
  Top 0.406: CPUSOCKET.47 68000.47
  Bottom 0.203: v19.43,8.57 19.72,8.29 38.01,8.29 40.58,5.71 CPUSOCKET.47 | 16V8.5 73.91,49.91 37.91,49.91 37.24,49.24 v19.05,49.24
A20  (via drill 0.3)
  Top 0.203: v42.39,36.58 42.39,29.72 42.29,29.62 42.29,6.57 43.05,5.81 CPUSOCKET.48 | v70.2,34.29 v70.2,46.1
  Top 0.406: CPUSOCKET.48 68000.48
  Bottom 0.203: U$1.67 22.48,36.58 v42.39,36.58 42.39,36.48 44.67,34.2 70.1,34.2 v70.2,34.29 | v70.2,46.1 77.15,46.1 78.68,47.62 16V8.4
A21  (via drill 0.3)
  Top 0.203: v47.53,39.05 47.34,38.86 47.34,32.58 | 47.34,32.58 47.34,8.29 48.1,7.53 48.1,5.81 CPUSOCKET.50 | v80.39,32.58 80.39,46.77 81.25,47.62 16V8.3 | v47.53,32.58 47.34,32.58
  Top 0.406: CPUSOCKET.50 68000.50
  Bottom 0.203: v47.53,39.05 25.15,39.05 24.19,40.01 U$1.2 | v47.53,32.58 v80.39,32.58
A22  (via drill 0.3)
  Top 0.203: v27.62,30.29 27.62,36.48 26.67,37.43 U$1.3 | v49.91,30.29 49.91,6.57 50.67,5.81 CPUSOCKET.51 | 16V8.2 85.25,46.2 v85.25,31.62
  Top 0.406: 68000.51 CPUSOCKET.51
  Bottom 0.203: v49.91,30.29 41.05,30.29 | 41.05,30.29 v27.62,30.29 | v85.25,31.62 41.53,31.62 41.05,31.15 41.05,30.29
A23  (via drill 0.3)
  Top 0.203: U$1.4 28.29,38.39 28.29,30.1 28.86,29.53 v28.86,3.43 | v82.87,3.43 82.87,6.67 83.34,7.14 83.34,14.76 87.25,18.67 87.25,46.77 86.39,47.62 16V8.1
  Top 0.406: CPUSOCKET.52 68000.52
  Bottom 0.203: 51.82,3.43 v28.86,3.43 | 68000.52 51.82,3.43 | 51.82,3.43 v82.87,3.43
ACSI10  (via drill 0.3)
  Top 0.203: v81.25,68.87 81.25,62.87 74LS03.3
  Bottom 0.203: v81.25,68.87 6.67,68.87 2.57,64.77 U$2.1
AS  (via drill 0.3)
  Top 0.203: 68000.6 71.15,24.77 71.15,28.57 CPUSOCKET.6 71.06,28.57 v71.06,38.29 | v64.39,54.29 64.39,40.86 63.53,40.01 16V8.11
  Bottom 0.203: U$1.23 35.24,54.29 v64.39,54.29 | v71.06,38.29 70.87,38.48 65.06,38.48 63.53,40.01 16V8.11
BERR
  Top 0.203: 68000.22 CPUSOCKET.22 30.48,40.01 20.67,49.82 20.67,61.25 U$1.39
BG
  Top 0.203: 68000.11 58.48,24.77 60.01,26.29 60.01,29.81 62.2,32 62.2,56.77 62.77,57.34 62.77,58.48 60.96,60.29 JP1.2
BGACK
  Top 0.203: 68000.12 55.91,24.77 57.53,26.38 57.53,36.01 60.67,39.15 60.67,51.05 58.96,52.77 58.96,58.48 57.15,60.29 JP2.2
BGKI
  Top 0.203: SJ2.1 58.58,51.15 58.58,47.15 60.29,45.43 60.29,39.34 55.91,34.96 55.91,28.57 CPUSOCKET.12
BGO
  Top 0.203: SJ1.1 61.63,51.91 61.63,32 58.48,28.86 58.48,28.57 CPUSOCKET.11
BIRQ
  Bottom 0.203: U$2.4 2.57,57.15 6.67,61.25 14.86,61.25 16.48,62.87 U$1.41 16.48,62.96 17.72,64.2 45.81,64.2 47.62,66.01 R8.1
BLTBGI
  Bottom 0.203: R1.1 48.72,63.96 | 48.72,63.96 47.91,63.15 37.05,63.15 34.29,60.39 U$1.28 | JP1.3 59.91,63.91 48.77,63.91 48.72,63.96
BR  (via drill 0.3)
  Top 0.203: 68000.13 CPUSOCKET.13 53.24,28.57 48.96,32.86 v48.96,59.05
  Bottom 0.203: v48.96,59.05 33.05,59.05 31.81,60.29 U$1.30
CLK  (via drill 0.3)
  Top 0.203: v48.29,58.39 48.58,58.1 48.58,28.77 CPUSOCKET.15
  Top 0.813: CPUSOCKET.15 68000.15
  Bottom 0.203: v48.29,58.39 48.01,58.67 28.29,58.67 26.67,60.29 U$1.34
D0  (via drill 0.3)
  Top 0.203: 68000.5 73.63,24.77 73.63,28.57 CPUSOCKET.5 73.53,28.57 73.53,29.81 72.77,30.57 72.77,44.2 | v73.06,52.67 73.06,48.96 72.77,48.67 72.77,44.2 | 72.77,44.2 v76.2,44.2
  Bottom 0.203: v73.06,52.67 72.77,52.39 44.1,52.39 42.86,53.63 35.15,53.63 34.29,52.77 U$1.21 | v76.2,44.2 94.58,44.2 95.54,45.15 CFCARD.17
D1  (via drill 0.3)
  Top 0.203: 77.82,42.2 77.82,30.19 CPUSOCKET.4 68000.4 | 77.82,42.2 v77.82,52.01 | v77.92,42.2 77.82,42.2
  Bottom 0.203: U$1.20 37.53,52.01 v77.82,52.01 | v77.92,42.2 94.58,42.2 95.54,43.15 CFCARD.15
D2  (via drill 0.3)
  Top 0.203: 68000.3 78.77,24.77 78.77,28.57 CPUSOCKET.3 | v72.39,30.1 v72.39,51.05
  Bottom 0.203: v72.39,51.05 35.15,51.05 34.29,50.2 U$1.19 | 77.15,30.1 v72.39,30.1 | 77.15,30.1 78.68,28.57 CPUSOCKET.3 | CFCARD.13 95.54,41.15 94.58,40.2 94.58,38.77 94.01,38.2 93.25,38.2 85.53,30.48 77.44,30.48 77.15,30.19 77.15,30.1
D3  (via drill 0.3)
  Top 0.203: 68000.2 81.25,24.77 81.25,28.57 CPUSOCKET.2 | v92.49,50.29 92.58,50.2 92.58,44.77 93.15,44.2 94.58,44.2 94.58,40.2 95.54,39.24 CFCARD.11
  Bottom 0.203: U$1.18 36.96,50.29 v92.49,50.29 | CPUSOCKET.2 81.34,28.57 82.87,30.1 85.72,30.1 91.82,36.2 94.01,36.2 94.58,36.77 94.58,38.2 95.54,39.15 CFCARD.11
D4  (via drill 0.3)
  Top 0.203: 68000.1 CPUSOCKET.1 v83.82,35.91 | U$1.17 35.91,46.01 v35.91,41.72
  Bottom 0.203: CPUSOCKET.1 84.77,28.57 90.39,34.2 94.58,34.2 94.58,36.2 95.54,37.15 CFCARD.9 | v35.91,41.72 36.01,41.62 47.62,41.62 53.34,35.91 v83.82,35.91
D5  (via drill 0.3)
  Top 0.203: v37.81,55.82 37.81,48.58 36.86,47.62 U$1.16 | 96.58,36.2 v96.58,54.2 | 96.58,36.2 95.63,35.24 CFCARD.7 | 96.58,36.2 96.58,27.43 85.06,15.91 85.06,6.86 84.01,5.81 CPUSOCKET.64
  Top 0.406: CPUSOCKET.64 68000.64
  Bottom 0.203: v37.81,55.82 38.1,56.1 70.1,56.1 70.77,56.77 84.2,56.77 85.44,55.53 85.44,53.72 92.77,53.72 93.25,54.2 v96.58,54.2
D6  (via drill 0.3)
  Top 0.203: v79.72,37.53 79.72,27.43 80.58,26.57 80.58,26 80.39,25.81 80.39,6.57 81.15,5.81 CPUSOCKET.63
  Top 0.406: CPUSOCKET.63 68000.63
  Bottom 0.203: CFCARD.5 95.63,33.24 96.58,34.2 96.58,42.2 95.25,42.2 94.58,41.53 94.58,40.77 94.01,40.2 88.49,40.2 86.01,37.72 79.82,37.72 79.72,37.62 v79.72,37.53 52.29,37.53 46.39,43.43 36.01,43.43 34.35,45.09 U$1.15
D7  (via drill 0.3)
  Top 0.203: 79.63,19.62 79.63,6.57 78.87,5.81 CPUSOCKET.62 | 79.63,19.62 79.63,26.38 v79.92,26.38 | v44.77,20 v44.77,45.05 | v79.53,19.62 79.63,19.62
  Top 0.406: 68000.62 CPUSOCKET.62
  Bottom 0.203: v79.92,26.38 80.2,26.67 89.63,26.67 93.15,30.19 94.58,30.19 95.54,31.15 CFCARD.3 | v44.77,45.05 36.86,45.05 U$1.14 | v44.77,20 60.48,20 60.87,19.62 v79.53,19.62
D8  (via drill 0.3)
  Top 0.203: v46.86,7.91 v46.86,40.96 | v77.15,27.05 77.15,6.57 76.39,5.81 CPUSOCKET.61
  Top 0.406: CPUSOCKET.61 68000.61
  Bottom 0.203: v46.86,40.96 35.81,40.96 34.29,42.48 U$1.13 | v46.86,7.91 47.15,7.62 74.3,7.62 CPUSOCKET.61 | v77.15,27.05 89.44,27.05 93.53,31.15 CFCARD.4
D9  (via drill 0.3)
  Top 0.203: v41.53,13.62 41.53,29.62 41.05,30.1 41.05,38.29 36.86,42.48 U$1.12 | CPUSOCKET.60 73.63,5.91 v73.63,13.62 v73.63,23.05 | v91.34,23.05 91.34,30.96 93.53,33.15 CFCARD.6
  Top 0.406: 68000.60 CPUSOCKET.60
  Bottom 0.203: v73.63,13.62 v41.53,13.62 | v73.63,23.05 v91.34,23.05
D10  (via drill 0.3)
  Top 0.203: U$1.11 36.48,37.81 v36.48,4.19 | v90.68,22.38 90.68,32.29 93.53,35.15 CFCARD.8 | v71.15,22.38 71.15,5.91 CPUSOCKET.59
  Top 0.406: CPUSOCKET.59 68000.59
  Bottom 0.203: v36.48,4.19 69.53,4.19 71.06,5.71 CPUSOCKET.59 | v71.15,22.38 v90.68,22.38
D11  (via drill 0.3)
  Top 0.203: v39.05,11.14 39.05,37.81 36.86,40.01 U$1.10 | CPUSOCKET.58 68.48,5.91 v68.48,11.14 v68.48,21.72 | v90.01,21.72 90.01,33.62 93.53,37.15 CFCARD.10
  Top 0.406: 68000.58 CPUSOCKET.58
  Bottom 0.203: v68.48,11.14 v39.05,11.14 | v68.48,21.72 v90.01,21.72
D12  (via drill 0.3)
  Top 0.203: v67.63,34.86 67.63,7.24 66.2,5.81 CPUSOCKET.57
  Top 0.406: CPUSOCKET.57 68000.57
  Bottom 0.203: U$1.9 34.29,37.43 34.48,37.24 50.86,37.24 53.15,34.96 67.63,34.96 v67.63,34.86 67.63,35.05 85.92,35.05 89.44,38.58 93.15,38.58 93.61,39.04 CFCARD.12
D13  (via drill 0.3)
  Top 0.203: v33.91,12.95 33.91,29.62 33.34,30.19 33.34,38.48 31.81,40.01 U$1.8 | CPUSOCKET.56 63.44,5.91 v63.44,12.95 v63.44,21.05 | v89.34,21.05 89.34,36.96 93.53,41.15 93.6,41.15 CFCARD.14
  Top 0.406: 68000.56 CPUSOCKET.56
  Bottom 0.203: v63.44,12.95 v33.91,12.95 | v63.44,21.05 v89.34,21.05
D14  (via drill 0.3)
  Top 0.203: U$1.7 31.43,37.15 v31.43,8.95 | v88.58,20.29 88.58,38.2 93.53,43.15 CFCARD.16 | v61.05,20.29 61.05,5.91 CPUSOCKET.55
  Top 0.406: CPUSOCKET.55 68000.55
  Bottom 0.203: v31.43,8.95 31.72,8.67 45.24,8.67 46.67,7.24 59.44,7.24 CPUSOCKET.55 | v61.05,20.29 v88.58,20.29
D15  (via drill 0.3)
  Top 0.203: v29.53,10.48 29.53,29.53 30.1,30.1 30.1,39.15 29.24,40.01 U$1.6 | v58.39,10.48 58.39,5.91 CPUSOCKET.54 | v82.68,10.48 v82.68,45.15
  Top 0.406: 68000.54 CPUSOCKET.54
  Bottom 0.203: v29.53,10.48 v58.39,10.48 v82.68,10.48 | v82.68,45.15 93.53,45.15 CFCARD.18
DTACK  (via drill 0.3)
  Top 0.203: 68000.10 CPUSOCKET.10 61.05,28.57 62.58,30.1 62.58,54.86 v62.87,55.15 | U$1.27 35.91,61.25 35.91,59.91 37.15,58.67 40.01,58.67 v40.01,55.44
  Bottom 0.203: v40.01,55.44 40.2,55.24 62.87,55.24 | 62.87,55.24 74LS03.8 71.15,55.15 72.58,53.72 77.15,53.72 78.68,55.24 74LS03.11 | v62.87,55.15 62.87,55.24
E
  Top 0.203: 68000.20 35.53,24.77 35.53,28.57 CPUSOCKET.20
FC0  (via drill 0.3)
  Top 0.203: CPUSOCKET.28 68000.28 | U$1.45 15.24,59.05 15.81,59.05 17.43,57.44 v17.43,30.29
  Bottom 0.203: v17.43,30.29 15.72,28.57 CPUSOCKET.28
FC1
  Top 0.203: 68000.27 17.81,24.77 17.81,28.57 CPUSOCKET.27 17.72,28.57 17.72,29.15 15.62,31.24 15.62,58.67 13.05,58.67 11.43,60.29 U$1.44
FC2
  Top 0.203: 68000.26 20.29,24.77 20.29,28.57 CPUSOCKET.26 20.38,28.57 20.38,39.24 20.29,39.34 20.29,55.15 15.62,59.82 15.62,61.25 14,62.87 U$1.43
GND
  pour Route2: -1.27,82.55 101.6,82.55 101.6,-1.27 -1.27,-1.27
HALT
  Top 0.203: 68000.17 43.15,24.77 43.15,28.57 CPUSOCKET.17
IDE_CS0  (via drill 0.3)
  Top 0.203: 16V8.13 69.53,40.96 v69.53,66.29
  Bottom 0.203: v69.53,66.29 69.63,66.2 94.58,66.2 95.54,65.25 CFCARD.37
IDE_CS1  (via drill 0.3)
  Top 0.203: v91.06,41.53 91.82,42.29 91.82,60.77 93.25,62.2 94.58,62.2 94.58,64.2 93.63,65.15 CFCARD.38
  Bottom 0.203: v91.06,41.53 82.87,41.53 82.87,39.72 81.63,38.48 72.68,38.48 71.15,40.01 16V8.14
IDE_IRQ
  Top 0.203: 74LS03.2 83.82,69.25 84.39,69.82 R7.1
  Bottom 0.203: 74LS03.2 74LS03.1 86.39,62.77 88.96,60.2 94.58,60.2 95.54,59.24 CFCARD.31
IDE_RD  (via drill 0.3)
  Top 0.203: v77.15,51.05 77.15,43.43 73.72,40.01 16V8.15
  Bottom 0.203: v77.15,51.05 92.11,51.05 93.25,52.2 94.58,52.2 95.54,53.15 CFCARD.25
IDE_WR
  Bottom 0.203: 16V8.16 75.53,40.67 75.53,45.72 82.39,45.72 82.77,46.1 89.15,46.1 93.25,50.2 94.58,50.2 95.54,51.15 CFCARD.23
IPL0
  Top 0.203: CPUSOCKET.25 68000.25
IPL1
  Top 0.203: 68000.24 25.43,24.77 25.43,28.57 CPUSOCKET.24
IPL2
  Top 0.203: 68000.23 27.91,24.77 27.91,28.57 CPUSOCKET.23
LDS  (via drill 0.3)
  Top 0.203: 68000.8 66.01,24.77 66.01,28.57 CPUSOCKET.8 | v43.53,57.15 43.53,30.1 44.1,29.53 v44.1,27.05
  Bottom 0.203: v43.53,57.15 43.24,56.86 35.15,56.86 34.29,57.72 U$1.25 | v44.1,27.05 64.48,27.05 66.01,28.57 CPUSOCKET.8
N$2
  Top 0.203: 16V8.17 78.77,40.01 80.01,41.24 80.01,54.01 81.25,55.24 74LS03.12
  Bottom 0.203: 74LS03.12 74LS03.13
N$3
  Top 0.203: 74LS03.9 73.63,55.24 73.63,62.87 74LS03.6 73.53,62.87 70.48,65.91 70.48,68.58 R3.1
  Bottom 0.203: 74LS03.10 74LS03.9
N$4
  Top 0.203: 74LS03.5 70.87,68.2 70.87,71.34 69.25,72.96 R4.1
  Bottom 0.203: 74LS03.5 74LS03.4 78.77,62.77 80.2,61.34 82.2,61.34 87.34,56.2 94.58,56.2 95.54,55.24 CFCARD.27
N$7  (via drill 0.3)
  Top 0.203: v96.58,72.96 96.58,58.2 95.63,57.24 CFCARD.29
  Bottom 0.203: v96.58,72.96 84.49,72.96 R6.2
N$13  (via drill 0.3)
  Top 0.203: v94.58,76.2 94.58,68.2 95.54,67.25 CFCARD.39
  Bottom 0.203: v94.58,76.2 R5.1
N$14
  Bottom 0.203: LED1.K 51.44,76.2 R5.2
RCEI  (via drill 0.3)
  Top 0.203: 16V8.19 84.77,39.05 84.77,33.43 v84.58,33.24 | v4.38,33.34 4.38,57.82 2.57,59.63 U$2.3
  Bottom 0.203: v84.58,33.24 27.15,33.24 27.05,33.34 v4.38,33.34
RCEO  (via drill 0.3)
  Top 0.203: v82.2,67.34 82.2,46.67 82.01,46.48 82.01,40.67 81.34,40.01 16V8.18
  Bottom 0.203: v82.2,67.34 27.34,67.34 25.62,65.63 5.91,65.63 2.57,62.29 U$2.2
RESET
  Top 0.203: 68000.18 40.67,24.77 40.67,28.57 CPUSOCKET.18 40.58,28.57 40.58,36.86 37.81,39.62 37.81,40.96 35.81,40.96 35.24,41.53 35.24,42.86 33.34,44.77 33.34,48.58 U$1.38
  Bottom 0.203: CFCARD.1 95.54,29.15 92.68,26.29 80.68,26.29 80.11,25.72 79.72,25.72 79.15,26.29 42.2,26.29 40.67,24.77 68000.18
RW  (via drill 0.3)
  Top 0.203: 68000.9 63.53,24.77 63.53,28.57 CPUSOCKET.9 63.63,28.57 65.06,30 65.06,40.86 65.15,40.86 | 65.15,40.86 v65.15,59.24 | 65.15,40.86 66.01,40.01 16V8.12
  Bottom 0.203: U$1.26 37.43,59.72 55.44,59.72 55.91,59.24 v65.15,59.24
UDS  (via drill 0.3)
  Top 0.203: CPUSOCKET.7 68000.7 | v41.72,30.96 41.72,52.86 36.86,57.72 U$1.24
  Bottom 0.203: v41.72,30.96 66.2,30.96 CPUSOCKET.7
VMA
  Top 0.203: CPUSOCKET.19 68000.19
VPA
  Top 0.203: 68000.21 33.05,24.77 33.05,28.57 CPUSOCKET.21

### Text on the board
tPlace: STBlitter Rev.A | www.happydaze.se | 68000